# EAGLE schematic Select Fire Rapidstrike (EAGLE 9.4.2)

## Sheet 1 of 3
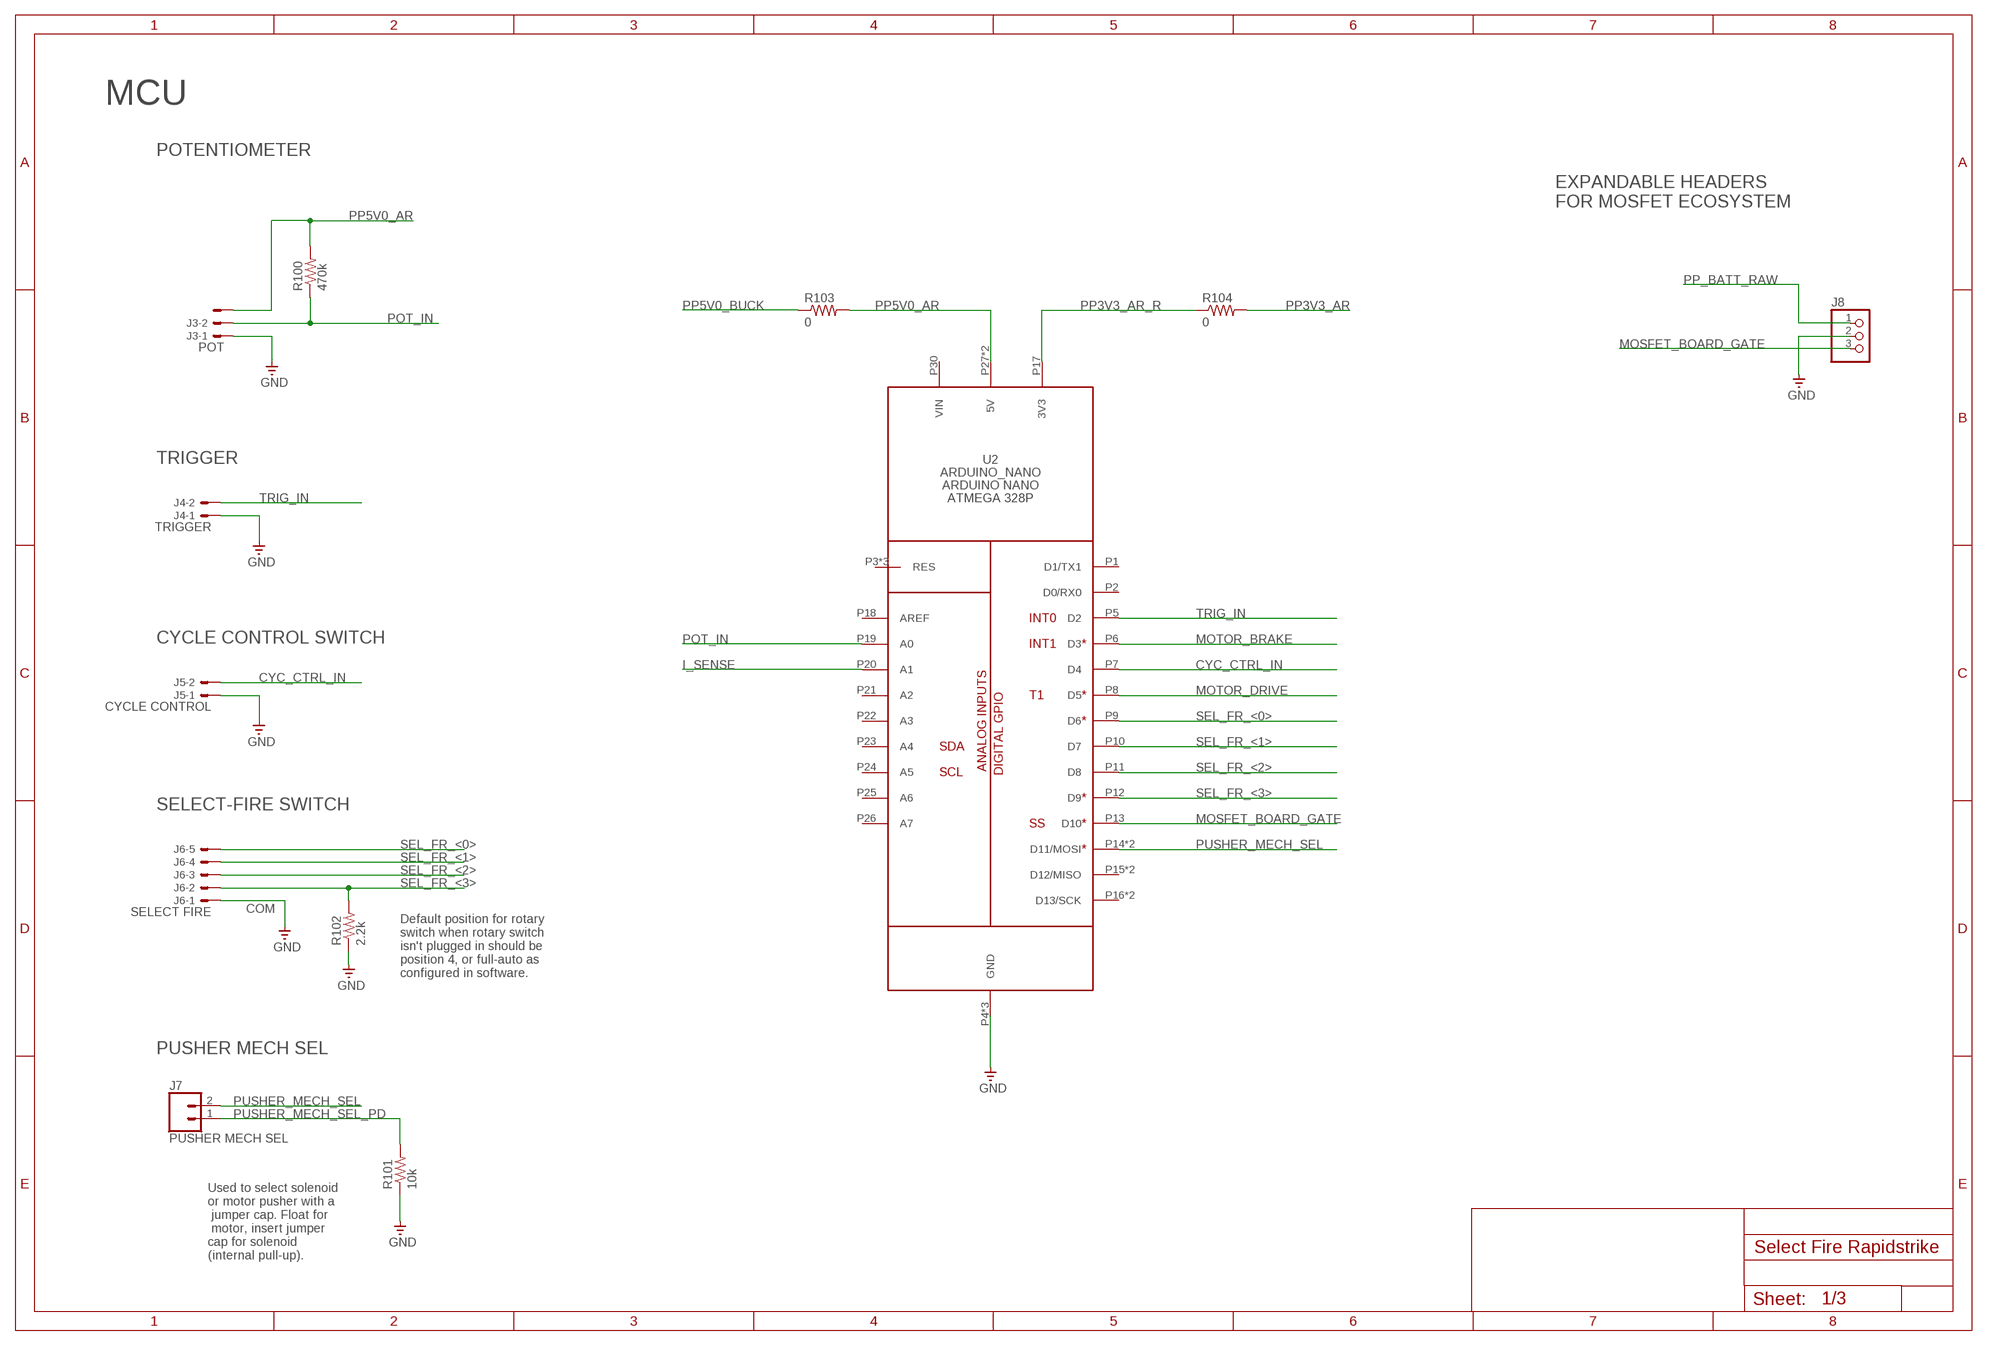
[diagram p0: schematic, sheet 1]

### Parts
J3  POT  JST-XH-03-PIN-LONG-PAD  [JST-XH-03-PACKAGE-LONG-PAD]
J4  TRIGGER  JST-XH-02-PIN-LONG-PAD  [JST-XH-02-PACKAGE-LONG-PAD]
J5  CYCLE CONTROL  JST-XH-02-PIN-LONG-PAD  [JST-XH-02-PACKAGE-LONG-PAD]
J6  SELECT FIRE  JST-XH-05-PIN-LONG-PAD  [JST-XH-05-PACKAGE-LONG-PAD]
J7  PUSHER MECH SEL  CONN_02  [1X02]
J8  PINHD-1X3  [1X03]
R100  470k  R-US_M0805  [M0805]
R101  10k  R-US_M0805  [M0805]
R102  2.2k  R-US_M0805  [M0805]
R103  0  R-US_M0805  [M0805]
R104  0  R-US_M0805  [M0805]
U2  ARDUINO_NANO  [ARDUINO_NANO]

### Nets
CYC_CTRL_IN: J5.2 U2.P7(D4)
GND: J3.1 J4.1 J5.1 J6.1 J8.2 R101.1 R102.1 U2.P4(GND) U2.P29(GND) U2.P32(GND) ; also sheet 2,3
I_SENSE: U2.P20(A1) ; also sheet 3
MOSFET_BOARD_GATE: J8.3 U2.P13(D10)
MOTOR_BRAKE: U2.P6(D3) ; also sheet 3
MOTOR_DRIVE: U2.P8(D5) ; also sheet 3
POT_IN: J3.2 R100.1 U2.P19(A0)
PP3V3_AR: R104.2 ; also sheet 2
PP3V3_AR_R: R104.1 U2.P17(3V3)
PP5V0_AR: J3.3 R100.2 R103.2 U2.P27(5V) U2.P36(5V) ; also sheet 2,3
PP5V0_BUCK: R103.1 ; also sheet 2
PP_BATT_RAW: J8.1 ; also sheet 2,3
PUSHER_MECH_SEL: J7.2 U2.P14(D11/MOSI) U2.P34(D11/MOSI)
PUSHER_MECH_SEL_PD: J7.1 R101.2
SEL_FR_<0>: J6.5 U2.P9(D6)
SEL_FR_<1>: J6.4 U2.P10(D7)
SEL_FR_<2>: J6.3 U2.P11(D8)
SEL_FR_<3>: J6.2 R102.2 U2.P12(D9)
TRIG_IN: J4.2 U2.P5(D2)
Unconnected: U2.P1(D1/TX1) U2.P2(D0/RX0) U2.P3(RES) U2.P15(D12/MISO) U2.P16(D13/SCK) U2.P18(AREF) U2.P21(A2) U2.P22(A3) U2.P23(A4) U2.P24(A5) U2.P25(A6) U2.P26(A7) U2.P28(RES) U2.P30(VIN) U2.P31(RES) U2.P33(D13/SCK) U2.P35(D12/MISO)

### Notes on the sheet
- MCU
- POTENTIOMETER
- EXPANDABLE HEADERS 
  FOR MOSFET ECOSYSTEM
- TRIGGER
- CYCLE CONTROL SWITCH
- SELECT-FIRE SWITCH
- COM
- Default position for rotary
  switch when rotary switch 
  isn't plugged in should be 
  position 4, or full-auto as 
  configured in software.
- PUSHER MECH SEL
- Used to select solenoid 
  or motor pusher with a
   jumper cap. Float for
   motor, insert jumper 
  cap for solenoid 
  (internal pull-up).

## Sheet 2 of 3
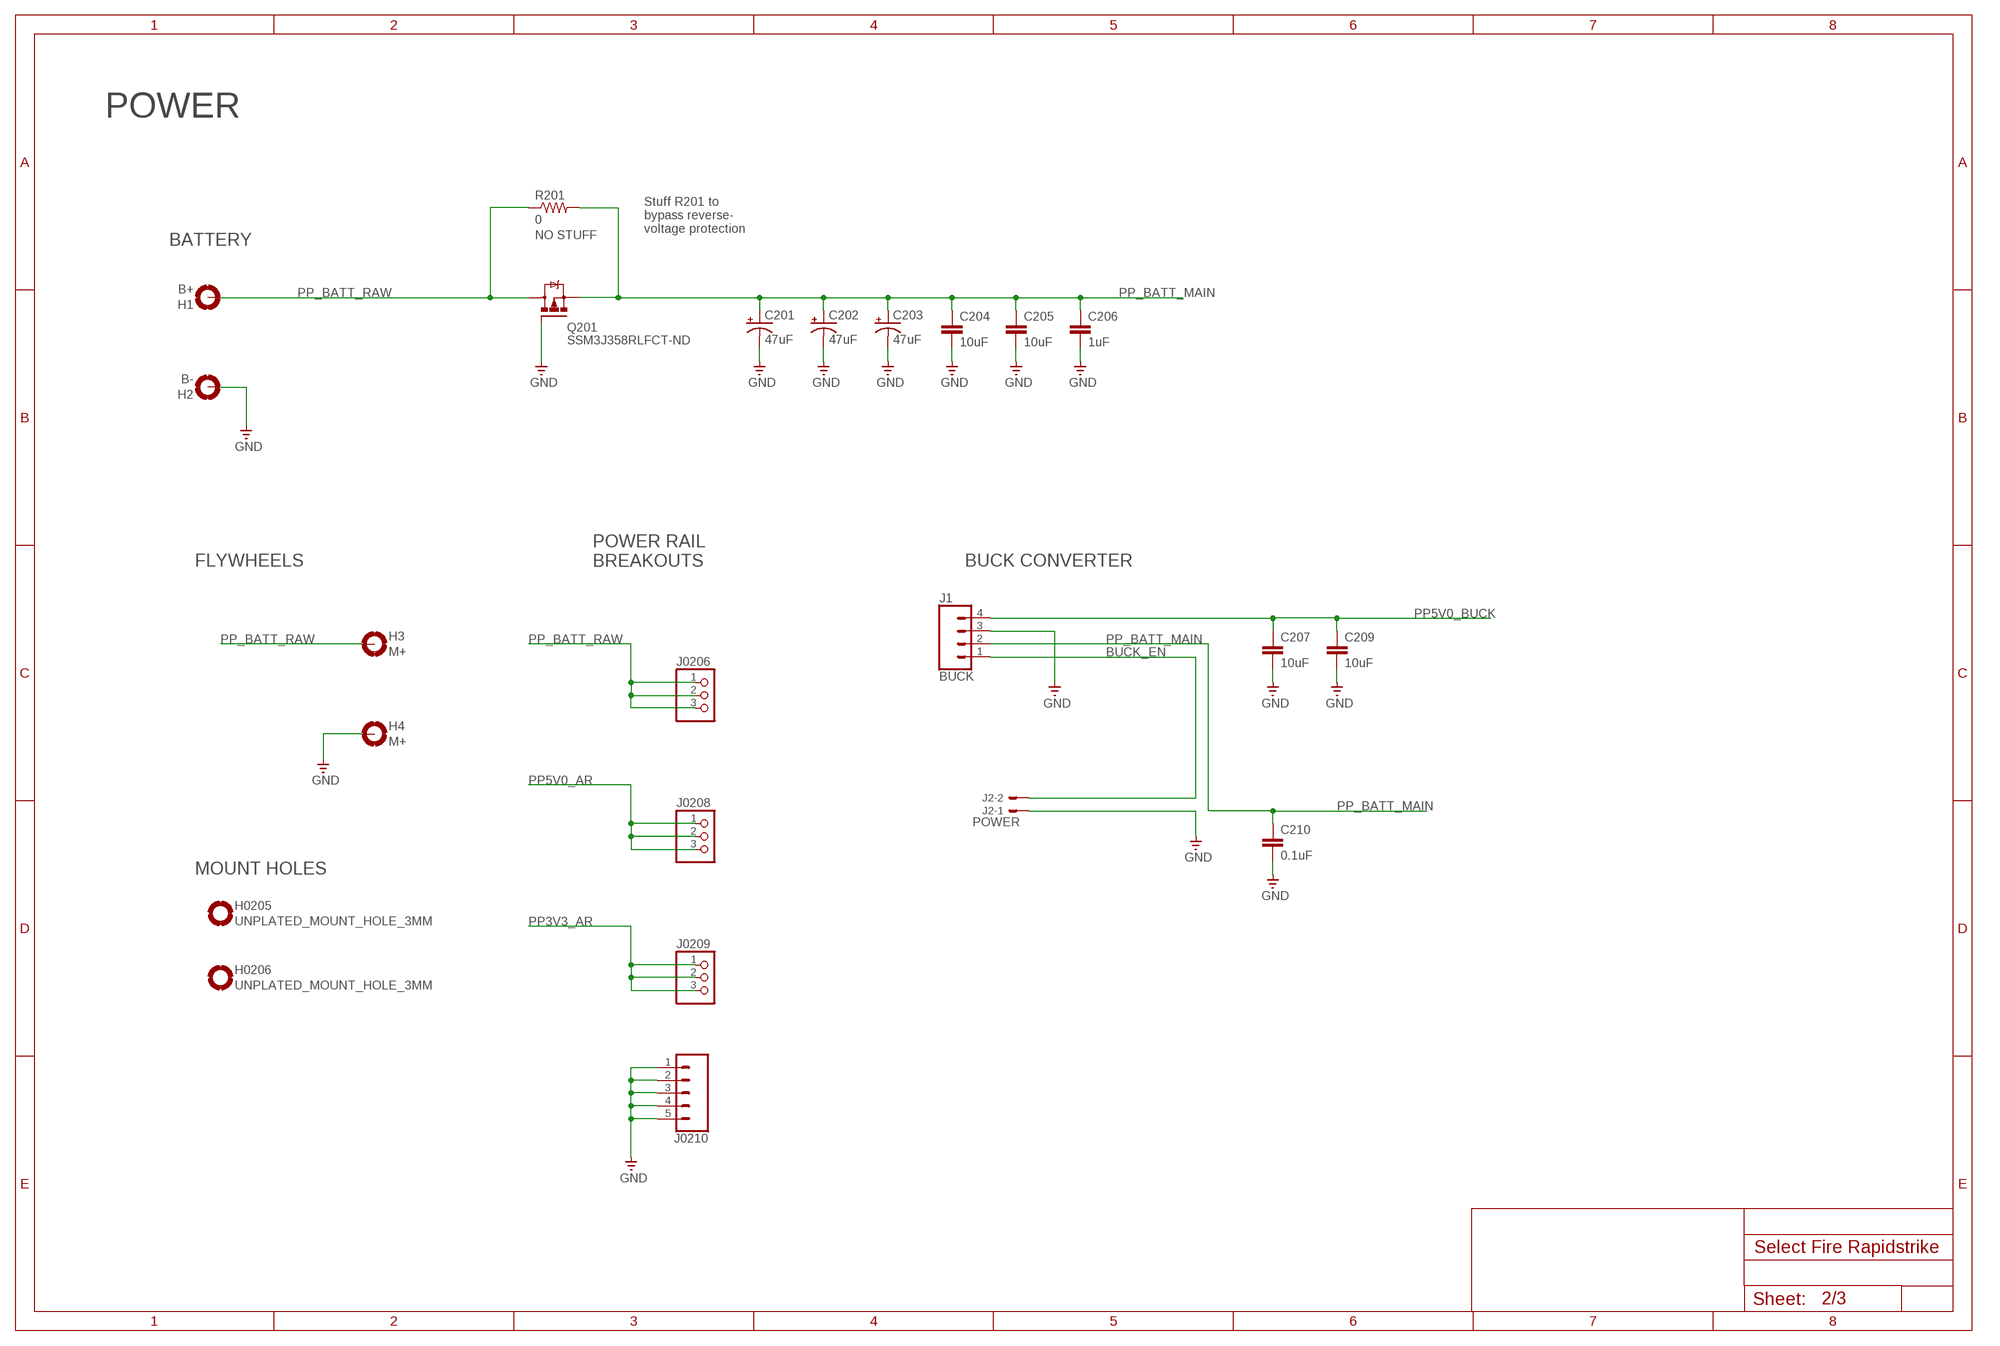
[diagram p1: schematic, sheet 2]

### Parts
C201  47uF  CPOL-USE2-5  [E2-5]
C202  47uF  CPOL-USE2-5  [E2-5]
C203  47uF  CPOL-USE2-5  [E2-5]
C204  10uF  CC1206  [C1206]
C205  10uF  CC1206  [C1206]
C206  1uF  C-EUC0805  [C0805]
C207  10uF  CC1206  [C1206]
C209  10uF  CC1206  [C1206]
C210  0.1uF  C-EUC0805  [C0805]
H1  B+  MOUNT-HOLE-2.5MM  [MOUNT-HOLE-2.5MM]
H2  B-  MOUNT-HOLE-2.5MM  [MOUNT-HOLE-2.5MM]
H3  M+  MOUNT-HOLE-2.5MM  [MOUNT-HOLE-2.5MM]
H4  M+  MOUNT-HOLE-2.5MM  [MOUNT-HOLE-2.5MM]
H0205  UNPLATED_MOUNT_HOLE_3MM  [UNPLATED_MOUNT_HOLE_3MM]
H0206  UNPLATED_MOUNT_HOLE_3MM  [UNPLATED_MOUNT_HOLE_3MM]
J1  BUCK  CONN_04  [1X04]
J2  POWER  JST-XH-02-PIN-LONG-PAD  [JST-XH-02-PACKAGE-LONG-PAD]
J0206  PINHD-1X3  [1X03]
J0208  PINHD-1X3  [1X03]
J0209  PINHD-1X3  [1X03]
J0210  CONN_05  [1X05]
Q201  SSM3J358RLFCT-ND  MOSFET-P-SOT23  [SOT-23]
R201  0  R-US_R1206  [R1206]

### Nets
BUCK_EN: J1.1 J2.2
GND: C201.- C202.- C203.- C204.2 C205.2 C206.2 C207.2 C209.2 C210.2 H2.P$1(MOUNT) H4.P$1(MOUNT) J1.3 J2.1 J0210.1 J0210.2 J0210.3 J0210.4 J0210.5 Q201.1(G) ; also sheet 1,3
PP3V3_AR: J0209.1 J0209.2 J0209.3 ; also sheet 1
PP5V0_AR: J0208.1 J0208.2 J0208.3 ; also sheet 1,3
PP5V0_BUCK: C207.1 C209.1 J1.4 ; also sheet 1
PP_BATT_MAIN: C201.+ C202.+ C203.+ C204.1 C205.1 C206.1 C210.1 J1.2 Q201.2(S) R201.2
PP_BATT_RAW: H1.P$1(MOUNT) H3.P$1(MOUNT) J0206.1 J0206.2 J0206.3 Q201.3(D) R201.1 ; also sheet 1,3

### Notes on the sheet
- POWER
- Stuff R201 to 
  bypass reverse-
  voltage protection
- BATTERY
- FLYWHEELS
- POWER RAIL
  BREAKOUTS
- BUCK CONVERTER
- MOUNT HOLES

## Sheet 3 of 3
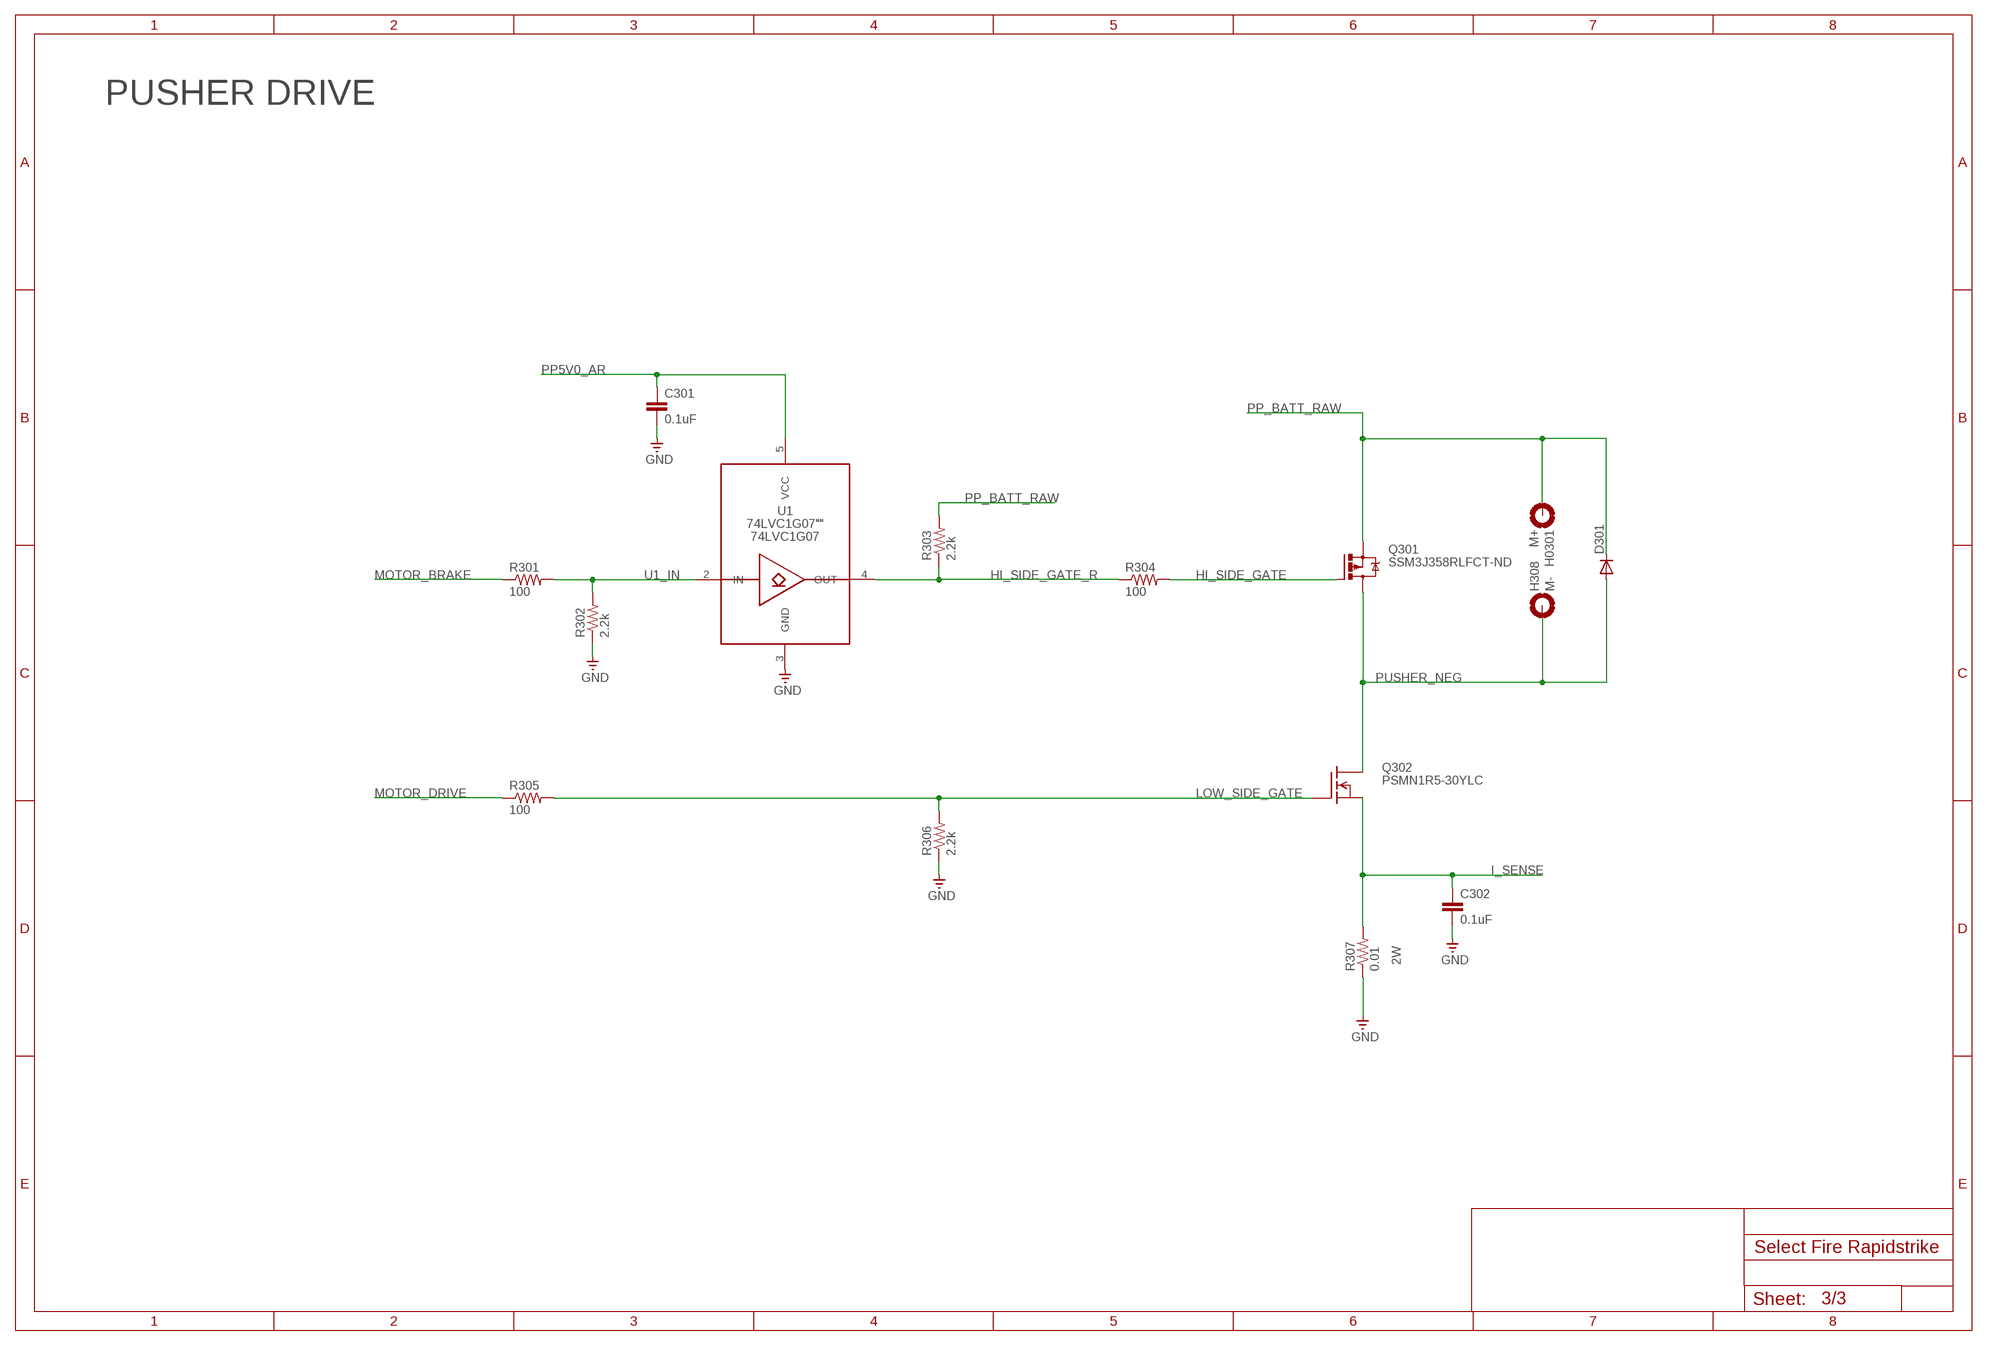
[diagram p2: schematic, sheet 3]

### Parts
C301  0.1uF  C-EUC0805  [C0805]
C302  0.1uF  C-EUC0805  [C0805]
D301  S2A  [DO214AA]
H0301  M+  MOUNT-HOLE-2.5MM  [MOUNT-HOLE-2.5MM]
H308  M-  MOUNT-HOLE-2.5MM  [MOUNT-HOLE-2.5MM]
Q301  SSM3J358RLFCT-ND  MOSFET-P-SOT23  [SOT-23]
Q302  PSMN1R5-30YLC  [TO127P600X120-5N]
R301  100  R-US_M0805  [M0805]
R302  2.2k  R-US_M0805  [M0805]
R303  2.2k  R-US_M0805  [M0805]
R304  100  R-US_M0805  [M0805]
R305  100  R-US_M0805  [M0805]
R306  2.2k  R-US_M0805  [M0805]
R307  0.01  R-US_R2512  [R2512]
U1  74LVC1G07""  [SOT353]

### Nets
GND: C301.2 C302.2 R302.1 R306.1 R307.1 U1.3(GND) ; also sheet 1,2
HI_SIDE_GATE: Q301.1(G) R304.2
HI_SIDE_GATE_R: R303.1 R304.1 U1.4(OUT)
I_SENSE: C302.1 Q302.1(S) Q302.2(S) Q302.3(S) R307.2 ; also sheet 1
LOW_SIDE_GATE: Q302.4(G) R305.2 R306.2
MOTOR_BRAKE: R301.1 ; also sheet 1
MOTOR_DRIVE: R305.1 ; also sheet 1
PP5V0_AR: C301.1 U1.5(VCC) ; also sheet 1,2
PP_BATT_RAW: D301.C H0301.P$1(MOUNT) Q301.2(S) R303.2 ; also sheet 1,2
PUSHER_NEG: D301.A H308.P$1(MOUNT) Q301.3(D) Q302.5(D)
U1_IN: R301.2 R302.2 U1.2(IN)

### Notes on the sheet
- PUSHER DRIVE

## Library data of the parts
C201-C203 = adafruit:CPOL-US: POLARIZED CAPACITOR, American symbol
C204 C205 C207 C209 = eagle-ltspice:C: CAPACITOR, European symbol; SPICEMODEL: NONE; SPICEPREFIX: C
C206 C210 C301 C302 = rcl:C-EU: CAPACITOR, European symbol; SPICEPREFIX: C
D301 = s2x_10:S2*: S2A - S2M General Purpose Rectifiers Source: http://www.fairchildsemi.com/datasheets/S2/S2A.pdf; MF: Fairchild; MPN: S2A; OC_FARNELL: 1467485; OC_NEWARK: 58K2391
H1-H4 H0301 H308 = my-eagle-lib:MOUNT-HOLE-2.5MM: Mount hole, 2.5mm inner diameter. Fits 14awg wiring great, 16awg a bit tight. Used in MOSFET board kit v1.2.
H0205 H0206 = my-eagle-lib:UNPLATED_MOUNT_HOLE_3MM
J1 = SparkFun-Connectors:CONN_04: Multi connection point. Often used as Generic Header-pin footprint for 0.1 inch spaced/style header connections On any of the 0.1 inch spaced packages, you can populate with these: Break Away Headers - Straight <https://www.sparkfun.com/products/116> (PRT-00116) Break Away Male Headers - Right Angle <https://www.sparkfun.com/products/553> (PRT-00553) Female Headers <https://www.sparkfun.com/products/115> (PRT-00115) Break Away Headers - Machine Pin <https://www.sparkfun.com/products/117> (PRT-00117) Break Away Female Headers - Swiss Machine Pin <https://www.sparkfun.com/products/743> (PRT-00743) For SCREWTERMINALS and SPRING TERMINALS visit here: Screw Terimnals on SparkFun.com <https://www.sparkfun.com/search/results?term=Screw+Terminals> (5mm/3.5mm/2.54mm spacing) This device is also useful as a general connection point to wire up your design to another part of your project. Our various solder wires solder well into these plated through hole pads. Hook-Up Wire - Assortment (Stranded, 22 AWG) <https://www.sparkfun.com/products/11375> (PRT-11375) Hook-Up Wire - Assortment (Solid Core, 22 AWG) <https://www.sparkfun.com/products/11367> (PRT-11367) View the entire wire category on our website here <https://www.sparkfun.com/categories/141> Special notes: Molex polarized connector foot print use with SKU : PRT-08231 with associated crimp pins and housings. 1MM SMD Version SKU: PRT-10208; PROD_ID: CONN-09696
J2 J4 J5 = Rembrandt Electronics - JST XH Connectors v1-0:JST-XH-02-PIN: JST XH Connector 2 Pin Wire to board connector. Pitch: 2,54 mm, (0.100") Number of pins: 2 Created by Rembrandt Electronics www.rembrandtelectronics.com
J3 = Rembrandt Electronics - JST XH Connectors v1-0:JST-XH-03-PIN: JST XH Connector 2 Pin Wire to board connector. Pitch: 2,54 mm, (0.100") Number of pins: 3 Created by Rembrandt Electronics www.rembrandtelectronics.com
J6 = Rembrandt Electronics - JST XH Connectors v1-0:JST-XH-05-PIN: JST XH Connector 2 Pin Wire to board connector. Pitch: 2,54 mm, (0.100") Number of pins: 5 Created by Rembrandt Electronics www.rembrandtelectronics.com
J7 = SparkFun-Connectors:CONN_02: Multi connection point. Often used as Generic Header-pin footprint for 0.1 inch spaced/style header connections On any of the 0.1 inch spaced packages, you can populate with these: Break Away Headers - Straight <https://www.sparkfun.com/products/116> (PRT-00116) Break Away Male Headers - Right Angle <https://www.sparkfun.com/products/553> (PRT-00553) Female Headers <https://www.sparkfun.com/products/115> (PRT-00115) Break Away Headers - Machine Pin <https://www.sparkfun.com/products/117> (PRT-00117) Break Away Female Headers - Swiss Machine Pin <https://www.sparkfun.com/products/743> (PRT-00743) For SCREWTERMINALS and SPRING TERMINALS visit here: Screw Terimnals on SparkFun.com <https://www.sparkfun.com/search/results?term=Screw+Terminals> (5mm/3.5mm/2.54mm spacing) This device is also useful as a general connection point to wire up your design to another part of your project. Our various solder wires solder well into these plated through hole pads. Hook-Up Wire - Assortment (Stranded, 22 AWG) <https://www.sparkfun.com/products/11375> (PRT-11375) Hook-Up Wire - Assortment (Solid Core, 22 AWG) <https://www.sparkfun.com/products/11367> (PRT-11367) View the entire wire category on our website here <https://www.sparkfun.com/categories/141> Special notes: Molex polarized connector foot print use with: PRT-08233 with associated crimp pins and housings. 2.54_SCREWTERM for use with PRT-10571. 3.5mm Screw Terminal footprints for PRT-08084 5mm Screw Terminal footprints for use with PRT-08432
J8 J0206 J0208 J0209 = adafruit:PINHD-1X3: PIN HEADER
J0210 = SparkFun-Connectors:CONN_05: Multi connection point. Often used as Generic Header-pin footprint for 0.1 inch spaced/style header connections On any of the 0.1 inch spaced packages, you can populate with these: Break Away Headers - Straight <https://www.sparkfun.com/products/116> (PRT-00116) Break Away Male Headers - Right Angle <https://www.sparkfun.com/products/553> (PRT-00553) Female Headers <https://www.sparkfun.com/products/115> (PRT-00115) Break Away Headers - Machine Pin <https://www.sparkfun.com/products/117> (PRT-00117) Break Away Female Headers - Swiss Machine Pin <https://www.sparkfun.com/products/743> (PRT-00743) For SCREWTERMINALS and SPRING TERMINALS visit here: Screw Terimnals on SparkFun.com <https://www.sparkfun.com/search/results?term=Screw+Terminals> (5mm/3.5mm/2.54mm spacing) This device is also useful as a general connection point to wire up your design to another part of your project. Our various solder wires solder well into these plated through hole pads. Hook-Up Wire - Assortment (Stranded, 22 AWG) <https://www.sparkfun.com/products/11375> (PRT-11375) Hook-Up Wire - Assortment (Solid Core, 22 AWG) <https://www.sparkfun.com/products/11367> (PRT-11367) View the entire wire category on our website here <https://www.sparkfun.com/categories/141> Special notes: Molex polarized connector foot print use with SKU : PRT-08231 with associated crimp pins and housings. 1MM SMD Version SKU: PRT-10208
Q201 Q301 = bt_transistor:MOSFET-P: P-Channel MOSFET with integrated body diode
Q302 = my-eagle-lib:PSMN1R5-30YLC: PSMN1R5-30YLC N-Channel Power MOSFET 30V, 100A, 1.55mΩ logic level MOSFET, surface-mount SOT669 package Datasheet <https://assets.nexperia.com/documents/data-sheet/PSMN1R5-30YLC.pdf> DigiKey Buy Link <https://www.digikey.com/product-detail/en/nexperia-usa-inc/PSMN1R5-30YLC115/1727-5297-1-ND/2674291> Package stolen from here <https://www.mikrocontroller.net/topic/236049> Symbol stolen from here <https://github.com/adafruit/Adafruit-Eagle-Library>
R100-R104 R301-R306 = adafruit:R-US_: RESISTOR, American symbol
R201 = adafruit:R-US_: RESISTOR, American symbol; STUFF: NO STUFF
R307 = adafruit:R-US_: RESISTOR, American symbol; POWER: 2W
U1 = my-eagle-lib:74LVC1G07: The 74LVC1G07 is a single buffer gate with an open-drain output. The device is designed for operation with a power supply range of 1.65V to 5.5V. The input is tolerant to 5.5V allowing this device to be used in a mixed voltage environment. The device is fully specified for partial power down applications using IOFF. The IOFF circuitry disables the output preventing damaging current backflow when the device is powered down. The open-drain output can be connected to other open drain outputs to implement active-low wired-OR or active-high wired-AND functions. The maximum sink current is 32mA. https://www.diodes.com/assets/Datasheets/74LVC1G07.pdf
U2 = my-eagle-lib:ARDUINO_NANO